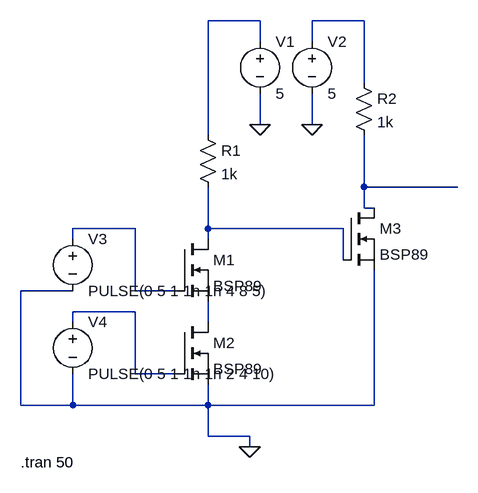
[diagram p0: schematic n_and.asc]
n_and.asc, the LTspice schematic file:
Version 4
SHEET 1 880 680
WIRE 272 -208 192 -208
WIRE 432 -208 352 -208
WIRE 272 -176 272 -208
WIRE 352 -176 352 -208
WIRE 432 -112 432 -208
WIRE 272 -48 272 -96
WIRE 352 -48 352 -96
WIRE 192 -32 192 -208
WIRE 432 48 432 -32
WIRE 576 48 432 48
WIRE 432 80 432 48
WIRE 448 80 432 80
WIRE 80 112 -16 112
WIRE 192 112 192 48
WIRE 400 112 192 112
WIRE -16 128 -16 112
WIRE 192 128 192 112
WIRE 400 160 400 112
WIRE -16 208 -96 208
WIRE 80 208 80 112
WIRE 144 208 80 208
WIRE 80 240 -16 240
WIRE -16 256 -16 240
WIRE 192 256 192 224
WIRE 80 336 80 240
WIRE 144 336 80 336
WIRE -96 384 -96 208
WIRE -16 384 -16 336
WIRE -16 384 -96 384
WIRE 192 384 192 352
WIRE 192 384 -16 384
WIRE 448 384 448 176
WIRE 448 384 192 384
WIRE 192 432 192 384
WIRE 256 432 192 432
WIRE 256 448 256 432
FLAG 256 448 0
FLAG 272 -48 0
FLAG 352 -48 0
SYMBOL res 176 -48 R0
SYMATTR InstName R1
SYMATTR Value 1k
SYMBOL res 416 -128 R0
SYMATTR InstName R2
SYMATTR Value 1k
SYMBOL voltage 272 -192 R0
WINDOW 123 0 0 Left 0
WINDOW 39 0 0 Left 0
SYMATTR InstName V1
SYMATTR Value 5
SYMBOL voltage 352 -192 R0
WINDOW 123 0 0 Left 0
WINDOW 39 0 0 Left 0
SYMATTR InstName V2
SYMATTR Value 5
SYMBOL voltage -16 112 R0
WINDOW 123 0 0 Left 0
WINDOW 39 0 0 Left 0
SYMATTR InstName V3
SYMATTR Value PULSE(0 5 1 1n 1n 4 8 5)
SYMBOL voltage -16 240 R0
WINDOW 123 0 0 Left 0
WINDOW 39 0 0 Left 0
SYMATTR InstName V4
SYMATTR Value PULSE(0 5 1 1n 1n 2 4 10)
SYMBOL nmos 144 128 R0
SYMATTR InstName M1
SYMATTR Value BSP89
SYMBOL nmos 144 256 R0
SYMATTR InstName M2
SYMATTR Value BSP89
SYMBOL nmos 400 80 R0
SYMATTR InstName M3
SYMATTR Value BSP89
TEXT -96 472 Left 2 !.tran 50

The netlist it stands for:
* n_and.asc
R1 N001 N005 1k
R2 N002 N003 1k
V1 N001 0 5
V2 N002 0 5
V3 N004 0 PULSE(0 5 1 1n 1n 4 8 5)
V4 N006 0 PULSE(0 5 1 1n 1n 2 4 10)
M1 N005 N004 N007 N007 BSP89
M2 N007 N006 0 0 BSP89
M3 N003 N005 0 0 BSP89
.model NMOS NMOS
.model PMOS PMOS
.lib standard.mos
.tran 50
.backanno
.end